# Altium schematic sheet F4_Fc_Board.SchDoc
size A2
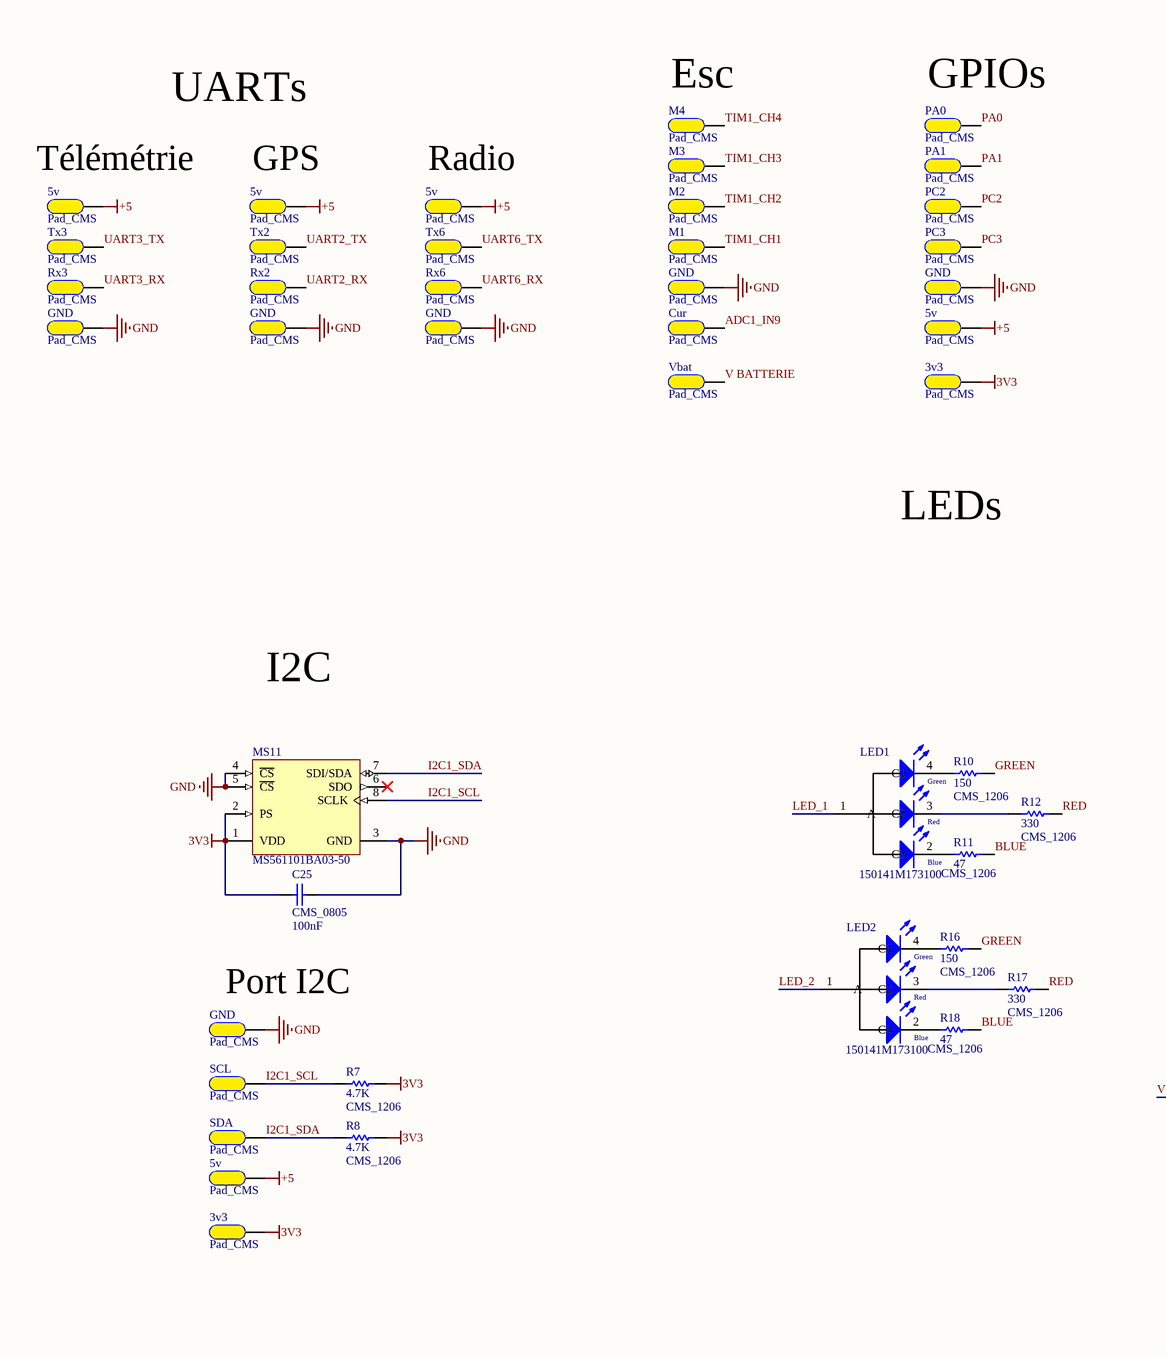
[diagram p0: F4_Fc_Board.SchDoc, left]
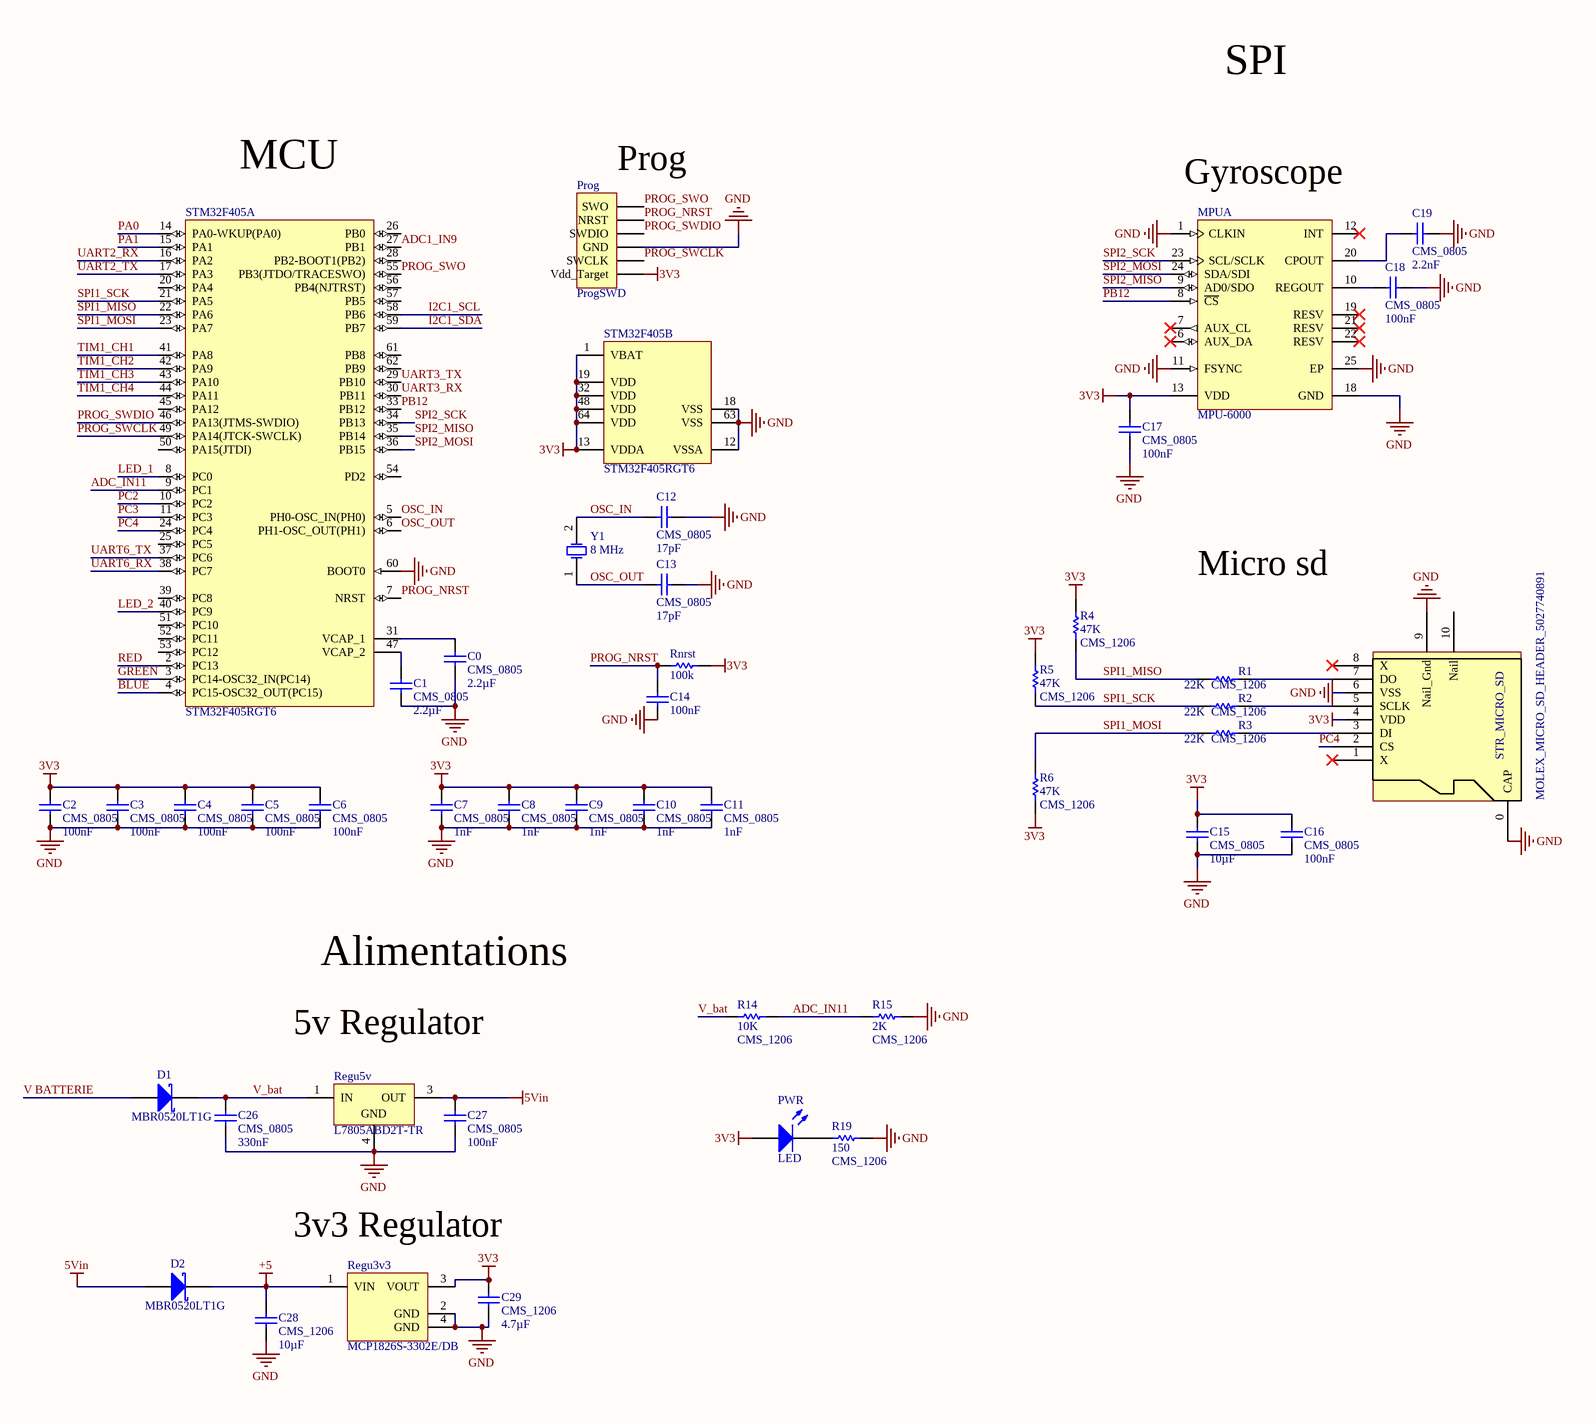
[diagram p1: F4_Fc_Board.SchDoc, right]

## Parts
3v3  Pad_CMS  [PAD_CMS_5.08x2.54]
3v3  Pad_CMS  [PAD_CMS_5.08x2.54]
5v  Pad_CMS  [PAD_CMS_5.08x2.54]
5v  Pad_CMS  [PAD_CMS_5.08x2.54]
5v  Pad_CMS  [PAD_CMS_5.08x2.54]
5v  Pad_CMS  [PAD_CMS_5.08x2.54]
5v  Pad_CMS  [PAD_CMS_5.08x2.54]
C0  value 2.2µF  [CONDENSATEUR_CMS_0805]  (hidden comment: CMS_0805)
C1  value 2.2µF  [CONDENSATEUR_CMS_0805]  (hidden comment: CMS_0805)
C2  value 100nF  [CONDENSATEUR_CMS_0805]  (hidden comment: CMS_0805)
C3  value 100nF  [CONDENSATEUR_CMS_0805]  (hidden comment: CMS_0805)
C4  value 100nF  [CONDENSATEUR_CMS_0805]  (hidden comment: CMS_0805)
C5  value 100nF  [CONDENSATEUR_CMS_0805]  (hidden comment: CMS_0805)
C6  value 100nF  [CONDENSATEUR_CMS_0805]  (hidden comment: CMS_0805)
C7  value 1nF  [CONDENSATEUR_CMS_0805]  (hidden comment: CMS_0805)
C8  value 1nF  [CONDENSATEUR_CMS_0805]  (hidden comment: CMS_0805)
C9  value 1nF  [CONDENSATEUR_CMS_0805]  (hidden comment: CMS_0805)
C10  value 1nF  [CONDENSATEUR_CMS_0805]  (hidden comment: CMS_0805)
C11  value 1nF  [CONDENSATEUR_CMS_0805]  (hidden comment: CMS_0805)
C12  value 17pF  [CONDENSATEUR_CMS_0805]  (hidden comment: CMS_0805)
C13  value 17pF  [CONDENSATEUR_CMS_0805]  (hidden comment: CMS_0805)
C14  100nF  [C0805_N]
C15  value 10µF  [CONDENSATEUR_CMS_0805]  (hidden comment: CMS_0805)
C16  value 100nF  [CONDENSATEUR_CMS_0805]  (hidden comment: CMS_0805)
C17  value 100nF  [CONDENSATEUR_CMS_0805]  (hidden comment: CMS_0805)
C18  value 100nF  [CONDENSATEUR_CMS_0805]  (hidden comment: CMS_0805)
C19  value 2.2nF  [CONDENSATEUR_CMS_0805]  (hidden comment: CMS_0805)
C25  value 100nF  [CONDENSATEUR_CMS_0805]  (hidden comment: CMS_0805)
C26  value 330nF  [CONDENSATEUR_CMS_0805]  (hidden comment: CMS_0805)
C27  value 100nF  [CONDENSATEUR_CMS_0805]  (hidden comment: CMS_0805)
C28  value 10µF  [CONDENSATEUR_CMS_1206]  (hidden comment: CMS_1206)
C29  value 4.7µF  [CONDENSATEUR_CMS_1206]  (hidden comment: CMS_1206)
Cur  Pad_CMS  [PAD_CMS_5.08x2.54]
D1  MBR0520LT1G  [ONSC-SOD-123-2-425-04_V]
D2  MBR0520LT1G  [ONSC-SOD-123-2-425-04_V]
GND  Pad_CMS  [PAD_CMS_5.08x2.54]
GND  Pad_CMS  [PAD_CMS_5.08x2.54]
GND  Pad_CMS  [PAD_CMS_5.08x2.54]
GND  Pad_CMS  [PAD_CMS_5.08x2.54]
GND  Pad_CMS  [PAD_CMS_5.08x2.54]
GND  Pad_CMS  [PAD_CMS_5.08x2.54]
LED1  150141M173100  [3528_A]
LED2  150141M173100  [3528_A]
M1  Pad_CMS  [PAD_CMS_5.08x2.54]
M2  Pad_CMS  [PAD_CMS_5.08x2.54]
M3  Pad_CMS  [PAD_CMS_5.08x2.54]
M4  Pad_CMS  [PAD_CMS_5.08x2.54]
MPU  MPU-6000  [INSE-QFN-24_V]  (part A of 2)
MS11  MS561101BA03-50  [MSI-MS561101BA03-50-8_V]
PA0  Pad_CMS  [PAD_CMS_5.08x2.54]
PA1  Pad_CMS  [PAD_CMS_5.08x2.54]
PC2  Pad_CMS  [PAD_CMS_5.08x2.54]
PC3  Pad_CMS  [PAD_CMS_5.08x2.54]
Prog  ProgSWD  [HDR1X6]
PWR  LED  [LED_1206]
R1  value 22K  Type: CMS_1206  [RESISTANCE_CMS_1206]  (hidden comment: RESISTANCE_CMS_1206)
R2  value 22K  Type: CMS_1206  [RESISTANCE_CMS_1206]  (hidden comment: RESISTANCE_CMS_1206)
R3  value 22K  Type: CMS_1206  [RESISTANCE_CMS_1206]  (hidden comment: RESISTANCE_CMS_1206)
R4  value 47K  Type: CMS_1206  [RESISTANCE_CMS_1206]  (hidden comment: RESISTANCE_CMS_1206)
R5  value 47K  Type: CMS_1206  [RESISTANCE_CMS_1206]  (hidden comment: RESISTANCE_CMS_1206)
R6  value 47K  Type: CMS_1206  [RESISTANCE_CMS_1206]  (hidden comment: RESISTANCE_CMS_1206)
R7  value 4.7K  Type: CMS_1206  [RESISTANCE_CMS_1206]  (hidden comment: RESISTANCE_CMS_1206)
R8  value 4.7K  Type: CMS_1206  [RESISTANCE_CMS_1206]  (hidden comment: RESISTANCE_CMS_1206)
R10  value 150  Type: CMS_1206  [RESISTANCE_CMS_1206]  (hidden comment: RESISTANCE_CMS_1206)
R11  value 47  Type: CMS_1206  [RESISTANCE_CMS_1206]  (hidden comment: RESISTANCE_CMS_1206)
R12  value 330  Type: CMS_1206  [RESISTANCE_CMS_1206]  (hidden comment: RESISTANCE_CMS_1206)
R14  value 10K  Type: CMS_1206  [RESISTANCE_CMS_1206]  (hidden comment: RESISTANCE_CMS_1206)
R15  value 2K  Type: CMS_1206  [RESISTANCE_CMS_1206]  (hidden comment: RESISTANCE_CMS_1206)
R16  value 150  Type: CMS_1206  [RESISTANCE_CMS_1206]  (hidden comment: RESISTANCE_CMS_1206)
R17  value 330  Type: CMS_1206  [RESISTANCE_CMS_1206]  (hidden comment: RESISTANCE_CMS_1206)
R18  value 47  Type: CMS_1206  [RESISTANCE_CMS_1206]  (hidden comment: RESISTANCE_CMS_1206)
R19  value 150  Type: CMS_1206  [RESISTANCE_CMS_1206]  (hidden comment: RESISTANCE_CMS_1206)
Regu3v3  MCP1826S-3302E/DB  [SOT-223-DB3_L]
Regu5v  L7805ABD2T-TR  [TO-263_M]
Rnrst  100k  [R1206_N]
Rx2  Pad_CMS  [PAD_CMS_5.08x2.54]
Rx3  Pad_CMS  [PAD_CMS_5.08x2.54]
Rx6  Pad_CMS  [PAD_CMS_5.08x2.54]
SCL  Pad_CMS  [PAD_CMS_5.08x2.54]
SDA  Pad_CMS  [PAD_CMS_5.08x2.54]
STM32F405  STM32F405RGT6  [STM-LQFP64_N]  (parts A,B of 2)
STR_MICRO_SD  MOLEX_MICRO_SD_HEADER_5027740891  [MOLEX_MICRO_SD_HEADER_5027740891]
Tx2  Pad_CMS  [PAD_CMS_5.08x2.54]
Tx3  Pad_CMS  [PAD_CMS_5.08x2.54]
Tx6  Pad_CMS  [PAD_CMS_5.08x2.54]
Vbat  Pad_CMS  [PAD_CMS_5.08x2.54]
Y1  8 MHz  [HC49/4H_SMX]

## Nets
3V3: 3v3.1 C2.1 C3.1 C4.1 C5.1 C6.1 C7.1 C8.1 C9.1 C10.1 C11.1 C15.1 C16.1 C17.2 C25.2 C29.2 MPU.13(VDD) MS11.1(VDD) MS11.2(PS) Prog.1(Vdd_Target) PWR.1(A) R4.2 R5.2 R6.1 R7.2 R8.2 Regu3v3.3(VOUT) Rnrst.2 STM32F405.1(VBAT) STM32F405.13(VDDA) STM32F405.19(VDD) STM32F405.32(VDD) STM32F405.48(VDD) STM32F405.64(VDD) STR_MICRO_SD.4(VDD)
5Vin: C27.1 D2.1(A) Regu5v.3(OUT)
+5: 5v.1 C28.2 D2.2(K) Regu3v3.1(VIN)
GND: C0.2 C1.2 C2.2 C3.2 C4.2 C5.2 C6.2 C7.2 C8.2 C9.2 C10.2 C11.2 C12.2 C13.2 C14.1 C15.2 C16.2 C17.1 C18.1 C19.1 C25.1 C26.2 C27.2 C28.1 C29.1 GND.1 MPU.1(CLKIN) MPU.11(FSYNC) MPU.18(GND) MPU.25(EP) MS11.3(GND) MS11.4(~{CS}) MS11.5(~{CS}) Prog.3(GND) R15.2 R19.2 Regu3v3.2(GND) Regu3v3.4(GND) Regu5v.4(GND) STM32F405.12(VSSA) STM32F405.18(VSS) STM32F405.60(BOOT0) STM32F405.63(VSS) STR_MICRO_SD.0(CAP) STR_MICRO_SD.6(VSS) STR_MICRO_SD.9(Nail_Gnd)
ADC1_IN9: Cur.1 STM32F405.27(PB1)
ADC_IN11: R14.2 R15.1 STM32F405.9(PC1)
BLUE: R11.2 R18.2 STM32F405.4(PC15-OSC32_OUT(PC15))
GREEN: R10.2 R16.2 STM32F405.3(PC14-OSC32_IN(PC14))
I2C1_SCL: MS11.8(SCLK) R7.1 SCL.1 STM32F405.58(PB6)
I2C1_SDA: MS11.7(SDI/SDA) R8.1 SDA.1 STM32F405.59(PB7)
LED_1: LED1.1(A) STM32F405.8(PC0)
LED_2: LED2.1(A) STM32F405.40(PC9)
OSC_IN: C12.1 STM32F405.5(PH0-OSC_IN(PH0)) Y1.2(OSC2)
OSC_OUT: C13.1 STM32F405.6(PH1-OSC_OUT(PH1)) Y1.1(OSC1)
PA0: PA0.1 STM32F405.14(PA0-WKUP(PA0))
PA1: PA1.1 STM32F405.15(PA1)
PB12: MPU.8(~{CS}) STM32F405.33(PB12)
PC2: PC2.1 STM32F405.10(PC2)
PC3: PC3.1 STM32F405.11(PC3)
PC4: STM32F405.24(PC4) STR_MICRO_SD.2(CS)
PROG_NRST: C14.2 Prog.5(NRST) Rnrst.1 STM32F405.7(NRST)
PROG_SWCLK: Prog.2(SWCLK) STM32F405.49(PA14(JTCK-SWCLK))
PROG_SWDIO: Prog.4(SWDIO) STM32F405.46(PA13(JTMS-SWDIO))
PROG_SWO: Prog.6(SWO) STM32F405.55(PB3(JTDO/TRACESWO))
RED: R12.2 R17.2 STM32F405.2(PC13)
SPI1_MISO: R1.1 R4.1 STM32F405.22(PA6)
SPI1_MOSI: R3.1 R6.2 STM32F405.23(PA7)
SPI1_SCK: R2.1 R5.1 STM32F405.21(PA5)
SPI2_MISO: MPU.9(AD0/SDO) STM32F405.35(PB14)
SPI2_MOSI: MPU.24(SDA/SDI) STM32F405.36(PB15)
SPI2_SCK: MPU.23(SCL/SCLK) STM32F405.34(PB13)
TIM1_CH1: M1.1 STM32F405.41(PA8)
TIM1_CH2: M2.1 STM32F405.42(PA9)
TIM1_CH3: M3.1 STM32F405.43(PA10)
TIM1_CH4: M4.1 STM32F405.44(PA11)
UART2_RX: Rx2.1 STM32F405.16(PA2)
UART2_TX: STM32F405.17(PA3) Tx2.1
UART3_RX: Rx3.1 STM32F405.30(PB11)
UART3_TX: STM32F405.29(PB10) Tx3.1
UART6_RX: Rx6.1 STM32F405.38(PC7)
UART6_TX: STM32F405.37(PC6) Tx6.1
V BATTERIE: D1.1(A) Vbat.1
V_bat: C26.1 D1.2(K) R14.1 Regu5v.1(IN)
NetC0_1: C0.1 STM32F405.31(VCAP_1)
NetC1_1: C1.1 STM32F405.47(VCAP_2)
NetC18_2: C18.2 MPU.10(REGOUT)
NetC19_2: C19.2 MPU.20(CPOUT)
NetLED1_2: LED1.2(C3) R11.1
NetLED1_3: LED1.3(C2) R12.1
NetLED1_4: LED1.4(C1) R10.1
NetLED2_2: LED2.2(C3) R18.1
NetLED2_3: LED2.3(C2) R17.1
NetLED2_4: LED2.4(C1) R16.1
NetPWR_2: PWR.2(K) R19.1
NetR1_2: R1.2 STR_MICRO_SD.7(DO)
NetR2_2: R2.2 STR_MICRO_SD.5(SCLK)
NetR3_2: R3.2 STR_MICRO_SD.3(DI)

Not connected (* = marked no-connect by the designer): MPU 6(AUX_DA)* 7(AUX_CL)* 12(INT)* 19(RESV)* 21(RESV)* 22(RESV)*; MS11 6(SDO)*; STM32F405 20(PA4) 25(PC5) 26(PB0) 28(PB2-BOOT1(PB2)) 39(PC8) 45(PA12) 50(PA15(JTDI)) 51(PC10) 52(PC11) 53(PC12) 54(PD2) 56(PB4(NJTRST)) 57(PB5) 61(PB8) 62(PB9); STR_MICRO_SD 1(X)* 8(X)* 10(Nail)

## Notes on the sheet
- UARTs
- (near M4) Esc
- (near PA0) GPIOs
- SPI
- (near 5v) Télémétrie
- (near 5v) GPS
- (near 5v) Radio
- MCU
- (near Prog) Prog
- (near MPU) Gyroscope
- LEDs
- Micro sd
- I2C
- (near GND) Port I2C
- Alimentations
- 5v Regulator
- 3v3 Regulator
- (in symbol CMP-1431-00001-1) Green; Red; Blue

## Library data of the parts
3v3 3v3 5v 5v 5v 5v 5v Cur GND GND GND GND GND GND M1-M4 PA0 PA1 PC2 PC3 Rx2 Rx3 Rx6 SCL SDA Tx2 Tx3 Tx6 Vbat = Pad_CMS: Pad pour souder un fil; LatestRevisionNote: Mech Layer 1 removed.; PackageReference: PAD_CMS; Publisher: Damien Guitton
C0-C13 C15-C19 C25-C27 = CONDENSATEUR_CMS_CER_0805: CONDENSATEUR CMS CERAMIQUE 0805; Type: CMS_0805
C14 = Condensateur: Capacitor; Published: 8-Jun-2000; LatestRevisionDate: 17-Jul-2002; LatestRevisionNote: Re-released for DXP Platform.; PackageReference: RAD-0.3; Publisher: Altium Limited
C28 C29 = CONDENSATEUR_CMS_CER_1206: CONDENSATEUR CMS CERAMIQUE 1206; Type: CMS_1206
D1 D2 = CMP-004-00003-1: Schottky Power Rectifier, 20 V, 5.5 A, -65 to 125 degC, 2-Pin SMD, RoHS, Tape and Reel; Manufacturer: ON Semiconductor; Peak Reverse Current: 250uA; Max Surge Current: 5.5A; Forward Voltage: 3.85dV; Forward Current: 5dA; Elements: 1; Datasheet Version: Rev. 6, 01/2012; Max Operating Temperature: 125°C; RoHS Compliant: True; Manufacturer URL: http://www.onsemi.com/; Packaging: TapeandReel; Datasheet URL: http://www.onsemi.cn/pub_link/Collateral/MBR0520LT1-D.PDF; Package Reference: SOD-123-2-425-04; Package Quantity: 3000; Min Operating Temperature: -65°C; Mounting Technology: SM; Package Description: 2-Pin Surface Mount Device, Body 2.69 x 1.6 mm; Case/Package: SOD; Pins: 2
LED1 LED2 = CMP-1431-00001-1: SMD Full-Color Top LED, WL-SFTW, Red & Green & Blue; Manufacturer: Wuerth Elektronik; PackageReference: 3528_A; PartNumber: 150141M173100; ComponentLink2Description: Datasheet; ComponentLink1URL: http://www.we-online.com; Color: Red & Green & Blue; ComponentLink1Description: Manufacturer URL; ComponentLink2URL: http://katalog.we-online.com/led/datasheet/150141M173100.pdf
MPU = CMP-2000-05008-1: 3-Axis Gyroscope 3-Axis Accelerometer Motion Processing Unit with I2C and SPI, 2.5, 3 or 3.3 V, -40 to 85 degC, 24-Pin QFN, RoHS, Tape and Reel; Manufacturer: InvenSense; Featured Product: MPU60006AxisIntegratedSPISolution; Output Type: I²C,SPI; Sensor Type: Accelerometer,Gyroscope,3Axis; Other Names: 1428-1005-2 / MPU6000; Online Catalog: MPU-6000™Series; Operating Temperature: -40degC~85degC(TA); Datasheet URL: https://www.invensense.com/wp-content/uploads/2015/02/MPU-6000-Datasheet1.pdf; Manufacturer URL: http://www.invensense.com/; Datasheet Version: Rev. 3.4, 08/2013; Standard Package: 5,000; Family: Multifunction; Package Reference: QFN-24; Category: Sensors,Transducers; Package Description: 24-Pin Quad Flat No-lead Package, Body 4 x 4 mm, Pitch 0.5 mm
MS11 = CMP-2000-05251-1: Barometric Pressure Sensor, with Stainless Steel Cap, 1.8 to 3.6 V, -45 to 85 degC, 8-Pin QFN, RoHS, Tape and Reel; Manufacturer: Measurement Specialties; Operating Pressure Max: 1200mbar; Supply Current: 12.5µA; Supply Voltage Max: 3.6V; Supply Voltage Min: 1.8V; No. of Pins: 8; Connection Size: 0.5mm; SVHC: NoSVHC(20-Jun-2013); Operating Pressure Min: 10mbar; Manufacturer URL: http://www.meas-spec.com/; Operating Temperature Min: -40degC; Pressure Type: Barometric; Package Reference: MS561101BA03-50-8; Datasheet URL: http://www.te.com/commerce/DocumentDelivery/DDEController?Action=srchrtrv&DocNm=MS5611-01BA03&DocType=Data+Sheet&DocLang=English&DocFormat=pdf&PartCntxt=CAT-BLPS0036; Package Description: 8-Pin Surface Mount Device, Body 5 x 3 mm, Pitch 1.25 mm; Sensor Case Style: QFN; Datasheet Version: Sep-15; Operating Temperature Max: 85degC
Prog = Header 6: Header, 6-Pin; LatestRevisionDate: 17-Jul-2002; LatestRevisionNote: Re-released for DXP Platform.; Publisher: Altium Limited
PWR = LED: Typical LED; Published: 8-Jun-2000; LatestRevisionDate: 08-Jul-2005; LatestRevisionNote: Mech Layer 1 removed.; PackageReference: LED-1; Publisher: Altium Limited
R1-R8 R10-R12 R14-R19 = RESISTANCE_CMS_1206: RESISTANCE CMS 1206
Regu3v3 = CMP-0136-00504-1: 1000 mA, Low Voltage, Low Quiescent Current LDO Regulator, 3-Pin SOT-223, Extended Temperature; PackageVersion: revBB, Aug-2009; PackageReference: SOT-223-DB3; DatasheetVersion: revA, Aug-2007; PackageDescription: 3-Lead Plastic Small Outline Transistor (DB) [SOT-223]
Regu5v = CMP-0244-00199-1: Positive Voltage Regulator, 3-Pin D2PAK, Tape and Reel; ComponentLink1Description: Manufacturer URL; ComponentLink1URL: http://www.st.com; ComponentLink2URL: http://www.st.com/internet/com/TECHNICAL_RESOURCES/TECHNICAL_LITERATURE/DATASHEET/CD00000444.pdf; PackageDescription: 3-Pin Transistor Outline Package 2.54 mm Pitch, 15.4 mm Lead Span (D2PAK); PackageVersion: 2011; PackageReference: TO-263; DatasheetVersion: 16/11/2011; ComponentLink2Description: Datasheet
Rnrst = Resistor: Published: 8-Jun-2000; LatestRevisionDate: 17-Jul-2002; LatestRevisionNote: Re-released for DXP Platform.; PackageReference: AXIAL-0.5; Publisher: Altium Limited
STM32F405 = STM32F405RGT6: ARM Cortex-M4 32-bit MCU+FPU, 210 DMIPS, 1024 kB Flash, 192 kB Internal RAM, 51 I/Os, 64-pin LQFP, -40 to 85 degC, Tray; Manufacturer: STMicroelectronics; D/A Converter: 2x12-bit; FLASH Size (Prog) (kB): 1024; I/Os (High Current): 51; Internal RAM Size (kB): 192; Operating Frequency(F) (Processor speed) (MHz): 168; Supply Voltage(Vcc) max (V): 3.6; Supply Voltage(Vcc) min (V): 1.8; DatasheetVersion: Rev. 4; PackageVersion: Rev. 4, 06/2013; PackageReference: LQFP64; PackageDescription: 64-Pin Low Profile Quad Flat Package, 10 x 10 mm Body, 0.5 mm Pitch; Supplier 1: Digi-Key; Supplier Part Number 1: 497-11767-ND; Supplier 2: Farnell; Supplier Part Number 2: 2064363; Supplier 3: Newark; Supplier Part Number 3: 73T2329; Supplier 4: Mouser; Supplier Part Number 4: 511-STM32F405RGT6; Core: ARM Cortex-M4; Packing: Tray; Mounting Technology: Surface Mount; PartNumber: STM32F405RGT6; ComponentLink1Description: Manufacturer URL; ComponentLink1URL: http://www.st.com/web/en/home.html; ComponentLink2Description: Datasheet; ComponentLink2URL: http://www.st.com/st-web-ui/static/active/en/resource/technical/document/datasheet/DM00037051.pdf; ComponentLink3Description: Package Specification; ComponentLink3URL: http://www.st.com/st-web-ui/static/active/en/resource/technical/document/datasheet/DM00037051.pdf
Y1 = Quartz: Crystal Oscillator; Published: 8-Jun-2000; LatestRevisionDate: 17-Jul-2002; LatestRevisionNote: Re-released for DXP Platform.; PackageReference: R38; Publisher: Altium Limited